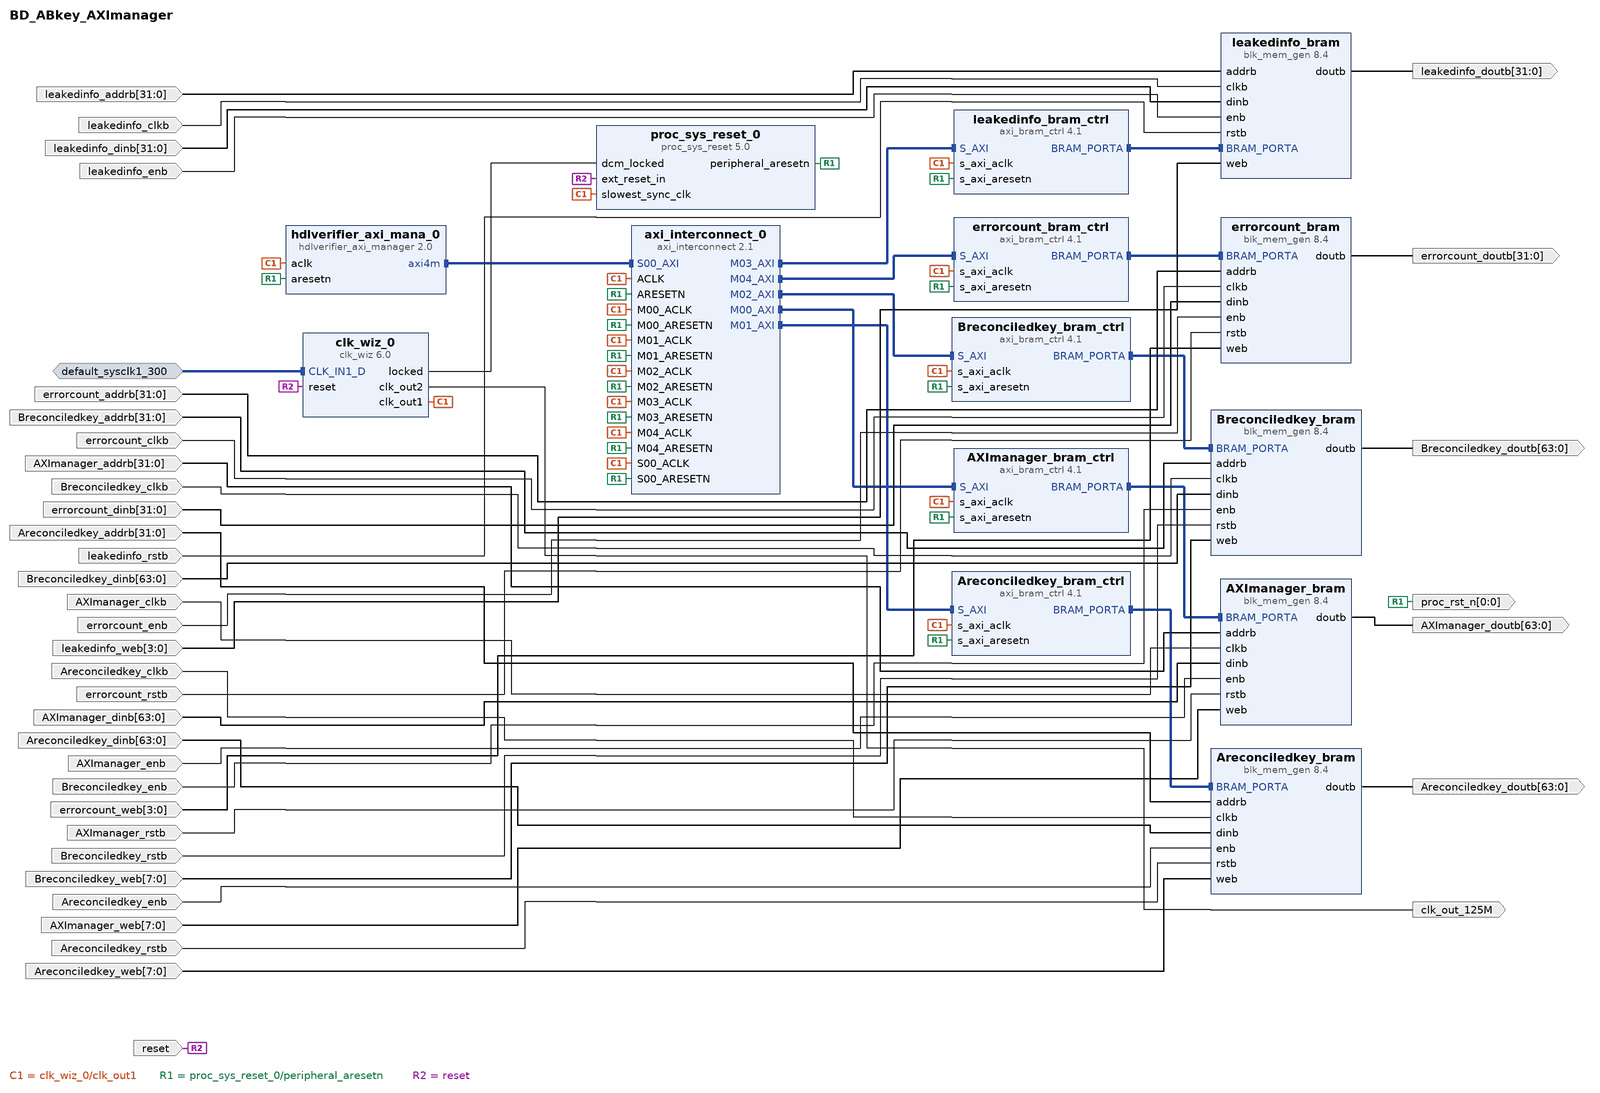
[diagram p0: block diagram of the top level]
# Vivado block design BD_ABkey_AXImanager, xcku5p-ffvb676-2-e, Vivado 2022.1
create_bd_design BD_ABkey_AXImanager

create_bd_intf_port -mode Slave -vlnv xilinx.com:interface:diff_clock_rtl:1.0 default_sysclk1_300
set_property -dict {CONFIG.FREQ_HZ 300000000} [get_bd_intf_ports default_sysclk1_300]
create_bd_port -dir I -type rst reset
set_property -dict {CONFIG.POLARITY ACTIVE_HIGH} [get_bd_ports reset]
create_bd_port -dir I -from 31 -to 0 AXImanager_addrb
create_bd_port -dir I -type clk AXImanager_clkb
create_bd_port -dir I -from 63 -to 0 AXImanager_dinb
create_bd_port -dir O -from 63 -to 0 AXImanager_doutb
create_bd_port -dir I AXImanager_enb
create_bd_port -dir I -type rst AXImanager_rstb
create_bd_port -dir I -from 7 -to 0 AXImanager_web
create_bd_port -dir O -type clk clk_out_125M
create_bd_port -dir O -from 0 -to 0 -type rst proc_rst_n
create_bd_port -dir I -type rst Areconciledkey_rstb
create_bd_port -dir I -from 31 -to 0 Areconciledkey_addrb
create_bd_port -dir I -from 63 -to 0 Areconciledkey_dinb
create_bd_port -dir I -type clk Areconciledkey_clkb
create_bd_port -dir I Areconciledkey_enb
create_bd_port -dir O -from 63 -to 0 Areconciledkey_doutb
create_bd_port -dir I -from 7 -to 0 Areconciledkey_web
create_bd_port -dir I -type rst Breconciledkey_rstb
create_bd_port -dir O -from 63 -to 0 Breconciledkey_doutb
create_bd_port -dir I Breconciledkey_enb
create_bd_port -dir I -type clk Breconciledkey_clkb
create_bd_port -dir I -from 63 -to 0 Breconciledkey_dinb
create_bd_port -dir I -from 31 -to 0 Breconciledkey_addrb
create_bd_port -dir I -from 7 -to 0 Breconciledkey_web
create_bd_port -dir I -type rst leakedinfo_rstb
create_bd_port -dir I -from 31 -to 0 leakedinfo_addrb
create_bd_port -dir I -from 31 -to 0 leakedinfo_dinb
create_bd_port -dir I -type clk leakedinfo_clkb
create_bd_port -dir I leakedinfo_enb
create_bd_port -dir O -from 31 -to 0 leakedinfo_doutb
create_bd_port -dir I -from 3 -to 0 leakedinfo_web
create_bd_port -dir I errorcount_enb
create_bd_port -dir O -from 31 -to 0 errorcount_doutb
create_bd_port -dir I -type rst errorcount_rstb
create_bd_port -dir I -from 31 -to 0 errorcount_addrb
create_bd_port -dir I -from 31 -to 0 errorcount_dinb
create_bd_port -dir I -type clk errorcount_clkb
create_bd_port -dir I -from 3 -to 0 errorcount_web

create_bd_cell -type ip -vlnv mathworks.com:ip:hdlverifier_axi_manager:2.0 hdlverifier_axi_mana_0
set_property -dict {CONFIG.AXI_ADDR_WIDTH 32 CONFIG.AXI_DATA_WIDTH 64} [get_bd_cells hdlverifier_axi_mana_0]
create_bd_cell -type ip -vlnv xilinx.com:ip:clk_wiz:6.0 clk_wiz_0
set_property -dict [list \
  CONFIG.CLKIN1_JITTER_PS 33.330000000000005 \
  CONFIG.CLKOUT1_DRIVES Buffer \
  CONFIG.CLKOUT1_JITTER 106.400 \
  CONFIG.CLKOUT1_PHASE_ERROR 84.520 \
  CONFIG.CLKOUT1_REQUESTED_OUT_FREQ 125.000 \
  CONFIG.CLKOUT2_DRIVES Buffer \
  CONFIG.CLKOUT2_JITTER 106.400 \
  CONFIG.CLKOUT2_PHASE_ERROR 84.520 \
  CONFIG.CLKOUT2_REQUESTED_OUT_FREQ 125.000 \
  CONFIG.CLKOUT2_USED true \
  CONFIG.CLKOUT3_DRIVES Buffer \
  CONFIG.CLKOUT4_DRIVES Buffer \
  CONFIG.CLKOUT5_DRIVES Buffer \
  CONFIG.CLKOUT6_DRIVES Buffer \
  CONFIG.CLKOUT7_DRIVES Buffer \
  CONFIG.CLK_IN1_BOARD_INTERFACE default_sysclk1_300 \
  CONFIG.FEEDBACK_SOURCE FDBK_AUTO \
  CONFIG.MMCM_BANDWIDTH OPTIMIZED \
  CONFIG.MMCM_CLKFBOUT_MULT_F 12.500 \
  CONFIG.MMCM_CLKIN1_PERIOD 3.333 \
  CONFIG.MMCM_CLKIN2_PERIOD 10.0 \
  CONFIG.MMCM_CLKOUT0_DIVIDE_F 10.000 \
  CONFIG.MMCM_CLKOUT1_DIVIDE 10 \
  CONFIG.MMCM_COMPENSATION AUTO \
  CONFIG.MMCM_DIVCLK_DIVIDE 3 \
  CONFIG.NUM_OUT_CLKS 2 \
  CONFIG.OPTIMIZE_CLOCKING_STRUCTURE_EN true \
  CONFIG.PRIMITIVE MMCM \
  CONFIG.PRIM_IN_FREQ 300.000 \
  CONFIG.PRIM_SOURCE Differential_clock_capable_pin \
  CONFIG.RESET_BOARD_INTERFACE reset \
  CONFIG.RESET_PORT reset \
  CONFIG.RESET_TYPE ACTIVE_HIGH \
  CONFIG.USE_BOARD_FLOW true \
  CONFIG.USE_RESET true \
] [get_bd_cells clk_wiz_0]
create_bd_cell -type ip -vlnv xilinx.com:ip:proc_sys_reset:5.0 proc_sys_reset_0
set_property -dict {CONFIG.RESET_BOARD_INTERFACE reset CONFIG.USE_BOARD_FLOW true} [get_bd_cells proc_sys_reset_0]
create_bd_cell -type ip -vlnv xilinx.com:ip:axi_interconnect:2.1 axi_interconnect_0
set_property -dict [list \
  CONFIG.M00_HAS_DATA_FIFO 1 \
  CONFIG.M00_HAS_REGSLICE 4 \
  CONFIG.M01_HAS_DATA_FIFO 1 \
  CONFIG.M01_HAS_REGSLICE 4 \
  CONFIG.M02_HAS_DATA_FIFO 1 \
  CONFIG.M02_HAS_REGSLICE 4 \
  CONFIG.M03_HAS_DATA_FIFO 1 \
  CONFIG.M03_HAS_REGSLICE 4 \
  CONFIG.M04_HAS_DATA_FIFO 1 \
  CONFIG.M04_HAS_REGSLICE 4 \
  CONFIG.M05_HAS_DATA_FIFO 1 \
  CONFIG.M06_HAS_DATA_FIFO 1 \
  CONFIG.NUM_MI 5 \
  CONFIG.S00_HAS_DATA_FIFO 1 \
  CONFIG.S00_HAS_REGSLICE 4 \
] [get_bd_cells axi_interconnect_0]
create_bd_cell -type ip -vlnv xilinx.com:ip:axi_bram_ctrl:4.1 AXImanager_bram_ctrl
set_property -dict [list \
  CONFIG.DATA_WIDTH 64 \
  CONFIG.RD_CMD_OPTIMIZATION 1 \
  CONFIG.SINGLE_PORT_BRAM 1 \
] [get_bd_cells AXImanager_bram_ctrl]
create_bd_cell -type ip -vlnv xilinx.com:ip:blk_mem_gen:8.4 AXImanager_bram
set_property -dict [list \
  CONFIG.Enable_B Use_ENB_Pin \
  CONFIG.Memory_Type True_Dual_Port_RAM \
  CONFIG.Port_B_Clock 100 \
  CONFIG.Port_B_Enable_Rate 100 \
  CONFIG.Port_B_Write_Rate 50 \
  CONFIG.Use_RSTB_Pin true \
] [get_bd_cells AXImanager_bram]
create_bd_cell -type ip -vlnv xilinx.com:ip:axi_bram_ctrl:4.1 Areconciledkey_bram_ctrl
set_property -dict [list \
  CONFIG.DATA_WIDTH 64 \
  CONFIG.RD_CMD_OPTIMIZATION 1 \
  CONFIG.SINGLE_PORT_BRAM 1 \
] [get_bd_cells Areconciledkey_bram_ctrl]
create_bd_cell -type ip -vlnv xilinx.com:ip:axi_bram_ctrl:4.1 Breconciledkey_bram_ctrl
set_property -dict [list \
  CONFIG.DATA_WIDTH 64 \
  CONFIG.RD_CMD_OPTIMIZATION 1 \
  CONFIG.SINGLE_PORT_BRAM 1 \
] [get_bd_cells Breconciledkey_bram_ctrl]
create_bd_cell -type ip -vlnv xilinx.com:ip:blk_mem_gen:8.4 Areconciledkey_bram
set_property -dict {CONFIG.Memory_Type True_Dual_Port_RAM} [get_bd_cells Areconciledkey_bram]
create_bd_cell -type ip -vlnv xilinx.com:ip:blk_mem_gen:8.4 Breconciledkey_bram
set_property -dict [list \
  CONFIG.Enable_B Use_ENB_Pin \
  CONFIG.Memory_Type True_Dual_Port_RAM \
  CONFIG.Port_B_Clock 100 \
  CONFIG.Port_B_Enable_Rate 100 \
  CONFIG.Port_B_Write_Rate 50 \
  CONFIG.Use_RSTB_Pin true \
] [get_bd_cells Breconciledkey_bram]
create_bd_cell -type ip -vlnv xilinx.com:ip:axi_bram_ctrl:4.1 leakedinfo_bram_ctrl
set_property -dict {CONFIG.RD_CMD_OPTIMIZATION 1 CONFIG.SINGLE_PORT_BRAM 1} [get_bd_cells leakedinfo_bram_ctrl]
create_bd_cell -type ip -vlnv xilinx.com:ip:blk_mem_gen:8.4 leakedinfo_bram
set_property -dict [list \
  CONFIG.Enable_B Use_ENB_Pin \
  CONFIG.Memory_Type True_Dual_Port_RAM \
  CONFIG.Port_B_Clock 100 \
  CONFIG.Port_B_Enable_Rate 100 \
  CONFIG.Port_B_Write_Rate 50 \
  CONFIG.Use_RSTB_Pin true \
] [get_bd_cells leakedinfo_bram]
create_bd_cell -type ip -vlnv xilinx.com:ip:axi_bram_ctrl:4.1 errorcount_bram_ctrl
set_property -dict [list \
  CONFIG.DATA_WIDTH 32 \
  CONFIG.RD_CMD_OPTIMIZATION 1 \
  CONFIG.SINGLE_PORT_BRAM 1 \
] [get_bd_cells errorcount_bram_ctrl]
create_bd_cell -type ip -vlnv xilinx.com:ip:blk_mem_gen:8.4 errorcount_bram
set_property -dict [list \
  CONFIG.Enable_B Use_ENB_Pin \
  CONFIG.Memory_Type True_Dual_Port_RAM \
  CONFIG.Port_B_Clock 100 \
  CONFIG.Port_B_Enable_Rate 100 \
  CONFIG.Port_B_Write_Rate 50 \
  CONFIG.Use_RSTB_Pin true \
] [get_bd_cells errorcount_bram]

# ---- connections ----

connect_bd_intf_net -intf_net axi_bram_ctrl_0_BRAM_PORTA [get_bd_intf_pins Areconciledkey_bram_ctrl/BRAM_PORTA] [get_bd_intf_pins Areconciledkey_bram/BRAM_PORTA]
connect_bd_intf_net -intf_net axi_bram_ctrl_0_BRAM_PORTA1 [get_bd_intf_pins leakedinfo_bram_ctrl/BRAM_PORTA] [get_bd_intf_pins leakedinfo_bram/BRAM_PORTA]
connect_bd_intf_net -intf_net axi_bram_ctrl_0_BRAM_PORTA2 [get_bd_intf_pins errorcount_bram_ctrl/BRAM_PORTA] [get_bd_intf_pins errorcount_bram/BRAM_PORTA]
connect_bd_intf_net -intf_net axi_bram_ctrl_1_BRAM_PORTA [get_bd_intf_pins Breconciledkey_bram_ctrl/BRAM_PORTA] [get_bd_intf_pins Breconciledkey_bram/BRAM_PORTA]
connect_bd_intf_net -intf_net axi_bram_ctrl_BRAM_PORTA [get_bd_intf_pins AXImanager_bram_ctrl/BRAM_PORTA] [get_bd_intf_pins AXImanager_bram/BRAM_PORTA]
connect_bd_intf_net [get_bd_intf_pins axi_interconnect_0/M00_AXI] [get_bd_intf_pins AXImanager_bram_ctrl/S_AXI]
connect_bd_intf_net [get_bd_intf_pins axi_interconnect_0/M01_AXI] [get_bd_intf_pins Areconciledkey_bram_ctrl/S_AXI]
connect_bd_intf_net [get_bd_intf_pins axi_interconnect_0/M02_AXI] [get_bd_intf_pins Breconciledkey_bram_ctrl/S_AXI]
connect_bd_intf_net [get_bd_intf_pins leakedinfo_bram_ctrl/S_AXI] [get_bd_intf_pins axi_interconnect_0/M03_AXI]
connect_bd_intf_net [get_bd_intf_pins axi_interconnect_0/M04_AXI] [get_bd_intf_pins errorcount_bram_ctrl/S_AXI]
connect_bd_intf_net -intf_net default_sysclk1_300_1 [get_bd_intf_ports default_sysclk1_300] [get_bd_intf_pins clk_wiz_0/CLK_IN1_D]
connect_bd_intf_net [get_bd_intf_pins hdlverifier_axi_mana_0/axi4m] [get_bd_intf_pins axi_interconnect_0/S00_AXI]
connect_bd_net [get_bd_pins AXImanager_bram/doutb] [get_bd_ports AXImanager_doutb]
connect_bd_net -net Asiftedkey_bram_doutb [get_bd_pins Areconciledkey_bram/doutb] [get_bd_ports Areconciledkey_doutb]
connect_bd_net -net Bsiftedkey_bram_doutb [get_bd_pins Breconciledkey_bram/doutb] [get_bd_ports Breconciledkey_doutb]
connect_bd_net -net addrb_0_1 [get_bd_ports AXImanager_addrb] [get_bd_pins AXImanager_bram/addrb]
connect_bd_net -net addrb_0_2 [get_bd_ports Areconciledkey_addrb] [get_bd_pins Areconciledkey_bram/addrb]
connect_bd_net -net addrb_0_3 [get_bd_ports Breconciledkey_addrb] [get_bd_pins Breconciledkey_bram/addrb]
connect_bd_net -net addrb_0_4 [get_bd_ports leakedinfo_addrb] [get_bd_pins leakedinfo_bram/addrb]
connect_bd_net -net addrb_0_5 [get_bd_ports errorcount_addrb] [get_bd_pins errorcount_bram/addrb]
connect_bd_net [get_bd_pins clk_wiz_0/clk_out1] \
  [get_bd_pins hdlverifier_axi_mana_0/aclk] [get_bd_pins axi_interconnect_0/S00_ACLK] \
  [get_bd_pins proc_sys_reset_0/slowest_sync_clk] [get_bd_pins axi_interconnect_0/M00_ACLK] \
  [get_bd_pins axi_interconnect_0/ACLK] [get_bd_pins AXImanager_bram_ctrl/s_axi_aclk] \
  [get_bd_pins Areconciledkey_bram_ctrl/s_axi_aclk] [get_bd_pins axi_interconnect_0/M01_ACLK] \
  [get_bd_pins Breconciledkey_bram_ctrl/s_axi_aclk] [get_bd_pins axi_interconnect_0/M02_ACLK] \
  [get_bd_pins errorcount_bram_ctrl/s_axi_aclk] [get_bd_pins axi_interconnect_0/M04_ACLK] \
  [get_bd_pins axi_interconnect_0/M03_ACLK] [get_bd_pins leakedinfo_bram_ctrl/s_axi_aclk]
connect_bd_net [get_bd_pins clk_wiz_0/clk_out2] [get_bd_ports clk_out_125M]
connect_bd_net [get_bd_pins clk_wiz_0/locked] [get_bd_pins proc_sys_reset_0/dcm_locked]
connect_bd_net -net clkb_0_1 [get_bd_ports AXImanager_clkb] [get_bd_pins AXImanager_bram/clkb]
connect_bd_net -net clkb_0_2 [get_bd_ports Areconciledkey_clkb] [get_bd_pins Areconciledkey_bram/clkb]
connect_bd_net -net clkb_0_3 [get_bd_ports Breconciledkey_clkb] [get_bd_pins Breconciledkey_bram/clkb]
connect_bd_net -net clkb_0_4 [get_bd_ports leakedinfo_clkb] [get_bd_pins leakedinfo_bram/clkb]
connect_bd_net -net clkb_0_5 [get_bd_ports errorcount_clkb] [get_bd_pins errorcount_bram/clkb]
connect_bd_net -net dinb_0_1 [get_bd_ports AXImanager_dinb] [get_bd_pins AXImanager_bram/dinb]
connect_bd_net -net dinb_0_2 [get_bd_ports Areconciledkey_dinb] [get_bd_pins Areconciledkey_bram/dinb]
connect_bd_net -net dinb_0_3 [get_bd_ports Breconciledkey_dinb] [get_bd_pins Breconciledkey_bram/dinb]
connect_bd_net -net dinb_0_4 [get_bd_ports leakedinfo_dinb] [get_bd_pins leakedinfo_bram/dinb]
connect_bd_net -net dinb_0_5 [get_bd_ports errorcount_dinb] [get_bd_pins errorcount_bram/dinb]
connect_bd_net -net enb_0_1 [get_bd_ports AXImanager_enb] [get_bd_pins AXImanager_bram/enb]
connect_bd_net -net enb_0_2 [get_bd_ports Areconciledkey_enb] [get_bd_pins Areconciledkey_bram/enb]
connect_bd_net -net enb_0_3 [get_bd_ports Breconciledkey_enb] [get_bd_pins Breconciledkey_bram/enb]
connect_bd_net -net enb_0_4 [get_bd_ports leakedinfo_enb] [get_bd_pins leakedinfo_bram/enb]
connect_bd_net -net enb_0_5 [get_bd_ports errorcount_enb] [get_bd_pins errorcount_bram/enb]
connect_bd_net [get_bd_pins errorcount_bram/doutb] [get_bd_ports errorcount_doutb]
connect_bd_net [get_bd_pins leakedinfo_bram/doutb] [get_bd_ports leakedinfo_doutb]
connect_bd_net [get_bd_pins proc_sys_reset_0/peripheral_aresetn] \
  [get_bd_pins hdlverifier_axi_mana_0/aresetn] [get_bd_pins axi_interconnect_0/S00_ARESETN] \
  [get_bd_pins axi_interconnect_0/M00_ARESETN] [get_bd_pins axi_interconnect_0/ARESETN] \
  [get_bd_pins AXImanager_bram_ctrl/s_axi_aresetn] [get_bd_ports proc_rst_n] \
  [get_bd_pins Areconciledkey_bram_ctrl/s_axi_aresetn] [get_bd_pins axi_interconnect_0/M01_ARESETN] \
  [get_bd_pins Breconciledkey_bram_ctrl/s_axi_aresetn] [get_bd_pins axi_interconnect_0/M02_ARESETN] \
  [get_bd_pins errorcount_bram_ctrl/s_axi_aresetn] [get_bd_pins axi_interconnect_0/M04_ARESETN] \
  [get_bd_pins axi_interconnect_0/M03_ARESETN] [get_bd_pins leakedinfo_bram_ctrl/s_axi_aresetn]
connect_bd_net [get_bd_ports reset] [get_bd_pins proc_sys_reset_0/ext_reset_in] [get_bd_pins clk_wiz_0/reset]
connect_bd_net -net rstb_0_1 [get_bd_ports AXImanager_rstb] [get_bd_pins AXImanager_bram/rstb]
connect_bd_net -net rstb_0_2 [get_bd_ports Areconciledkey_rstb] [get_bd_pins Areconciledkey_bram/rstb]
connect_bd_net -net rstb_0_3 [get_bd_ports Breconciledkey_rstb] [get_bd_pins Breconciledkey_bram/rstb]
connect_bd_net -net rstb_0_4 [get_bd_ports leakedinfo_rstb] [get_bd_pins leakedinfo_bram/rstb]
connect_bd_net -net rstb_0_5 [get_bd_ports errorcount_rstb] [get_bd_pins errorcount_bram/rstb]
connect_bd_net -net web_0_1 [get_bd_ports AXImanager_web] [get_bd_pins AXImanager_bram/web]
connect_bd_net -net web_0_2 [get_bd_ports Areconciledkey_web] [get_bd_pins Areconciledkey_bram/web]
connect_bd_net -net web_0_3 [get_bd_ports Breconciledkey_web] [get_bd_pins Breconciledkey_bram/web]
connect_bd_net -net web_0_4 [get_bd_ports leakedinfo_web] [get_bd_pins leakedinfo_bram/web]
connect_bd_net -net web_0_5 [get_bd_ports errorcount_web] [get_bd_pins errorcount_bram/web]

# ---- address map ----
assign_bd_address -offset 0x10000000 -range 256K -target_address_space [get_bd_addr_spaces hdlverifier_axi_mana_0/axi4m] [get_bd_addr_segs Areconciledkey_bram_ctrl/S_AXI/Mem0]
assign_bd_address -offset 0x20000000 -range 256K -target_address_space [get_bd_addr_spaces hdlverifier_axi_mana_0/axi4m] [get_bd_addr_segs Breconciledkey_bram_ctrl/S_AXI/Mem0]
assign_bd_address -offset 0x30000000 -range 4K -target_address_space [get_bd_addr_spaces hdlverifier_axi_mana_0/axi4m] [get_bd_addr_segs leakedinfo_bram_ctrl/S_AXI/Mem0]
assign_bd_address -offset 0x40000000 -range 4K -target_address_space [get_bd_addr_spaces hdlverifier_axi_mana_0/axi4m] [get_bd_addr_segs errorcount_bram_ctrl/S_AXI/Mem0]
assign_bd_address -offset 0xC0000000 -range 8K -target_address_space [get_bd_addr_spaces hdlverifier_axi_mana_0/axi4m] [get_bd_addr_segs AXImanager_bram_ctrl/S_AXI/Mem0]

validate_bd_design
save_bd_design
